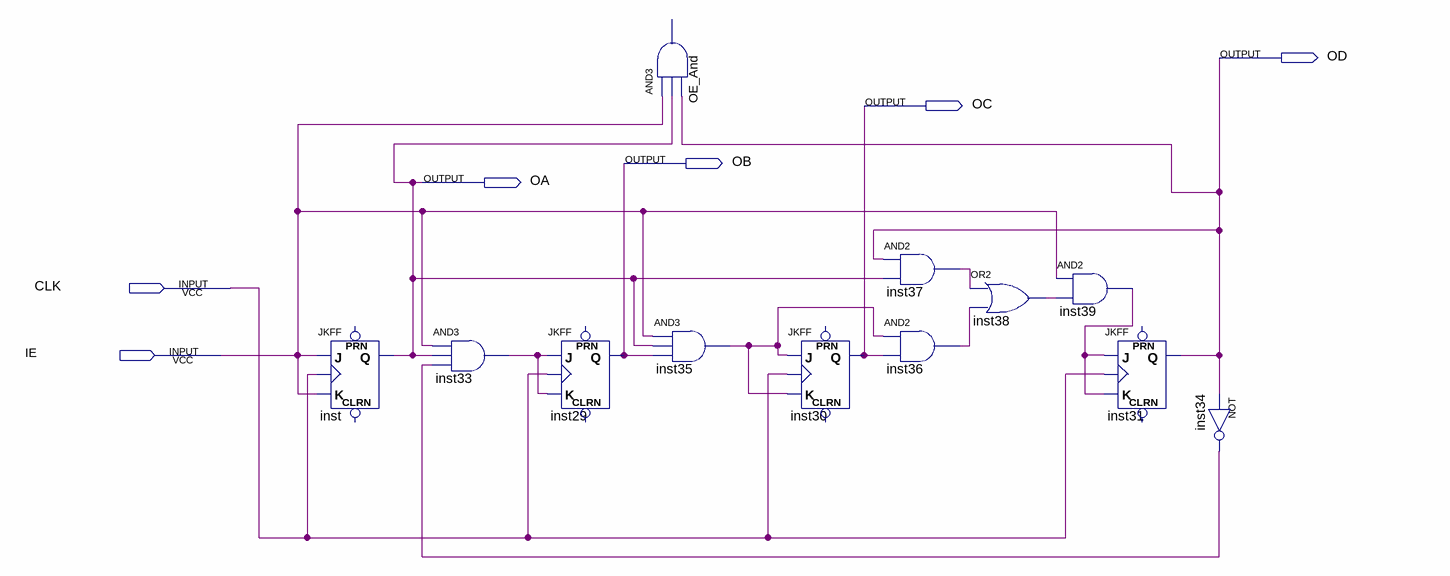
[diagram p0: schematic sheet]
// Quartus schematic mod_10_counter_with_enable.bdf as structural Verilog: 12 symbols, 6 pins
module mod_10_counter_with_enable (
  input  CLK,
  input  IE,
  output OD,
  output OC,
  output OB,
  output OA
);

  wire inst33_out, inst34_out, inst35_out, inst36_out, inst37_out, inst38_out, inst39_out;

  JKFF inst (.K(IE), .J(IE), .CLK(CLK), .Q(OA));  // open: PRN, CLRN
  and inst33 (inst33_out, IE, OA, inst34_out);
  JKFF inst29 (.K(inst33_out), .J(inst33_out), .CLK(CLK), .Q(OB));  // open: PRN, CLRN
  // AND3 OE_And has open pins: IN1=IE, IN2=OA, IN3=OD, OUT=open
  and inst35 (inst35_out, IE, OA, OB);
  JKFF inst30 (.K(inst35_out), .J(inst35_out), .CLK(CLK), .Q(OC));  // open: PRN, CLRN
  and inst37 (inst37_out, OD, OA);
  and inst36 (inst36_out, inst35_out, OC);
  or inst38 (inst38_out, inst37_out, inst36_out);
  and inst39 (inst39_out, IE, inst38_out);
  JKFF inst31 (.K(inst39_out), .J(inst39_out), .CLK(CLK), .Q(OD));  // open: PRN, CLRN
  not inst34 (inst34_out, OD);
endmodule
